# Altium project pcb_power_as.PrjPCB
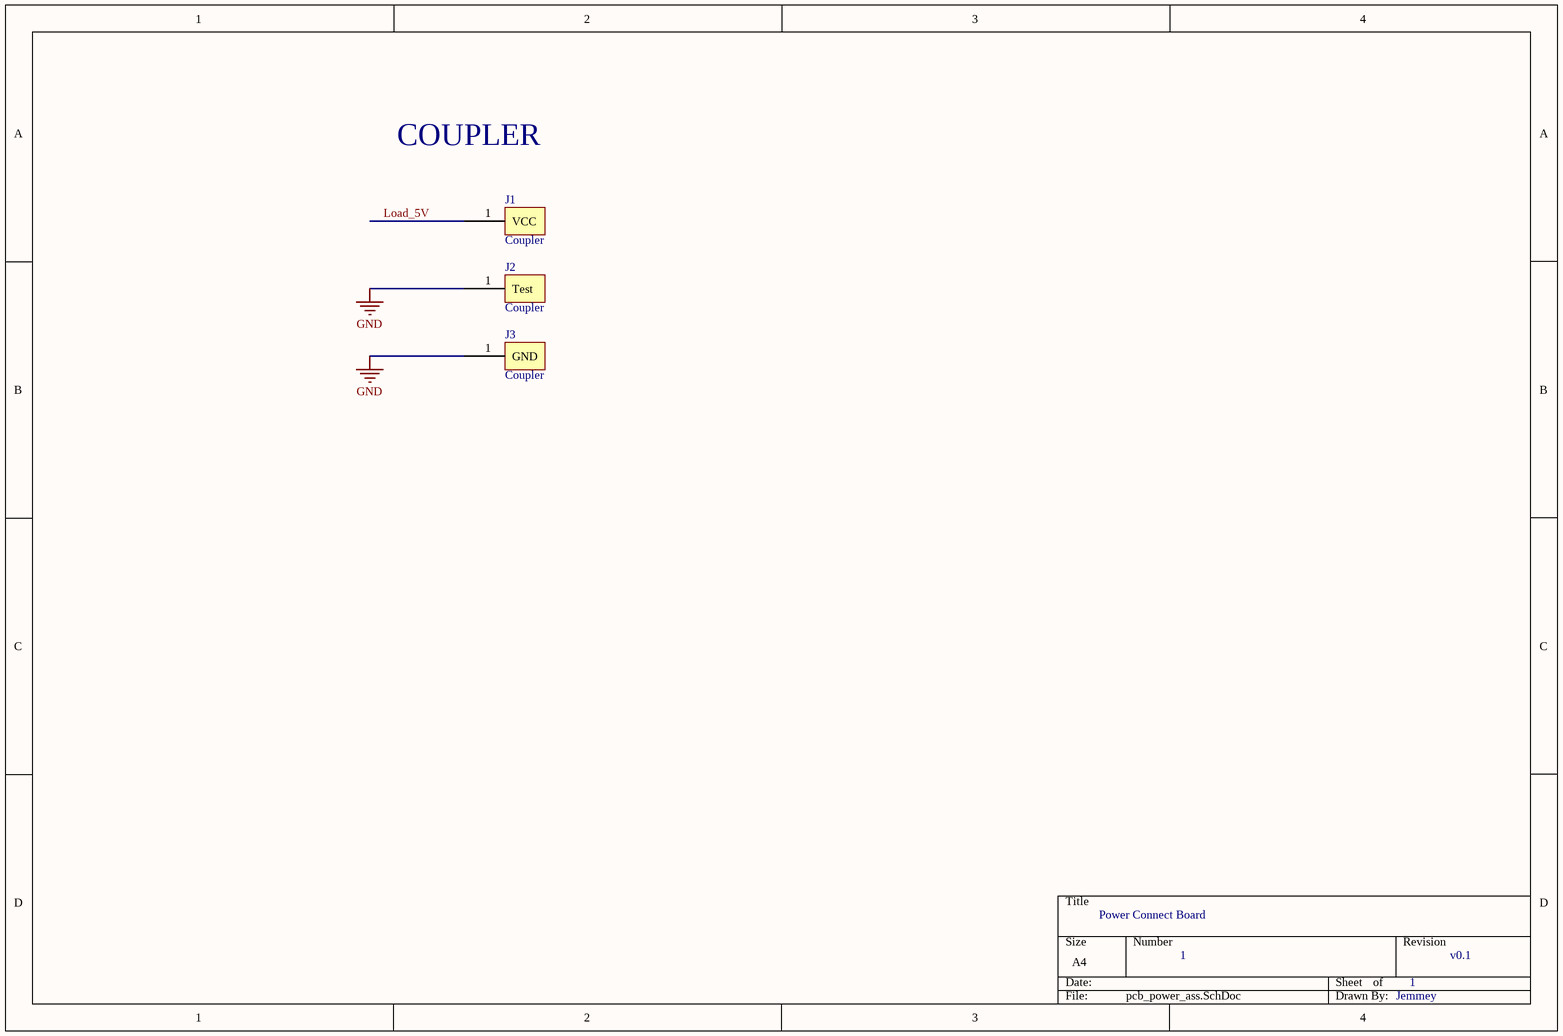
[diagram p0: pcb_power_ass.SchDoc]
1 sheet, 3 parts. Net scope: global (net labels, ports and power ports of the same name join across sheets).
Board file: pcb_power_ass.PcbDoc

## Sheet pcb_power_ass.SchDoc
size A4

### Parts
J1  Coupler  [Charge_Coupler - 1]
J2  Coupler  [Charge_Coupler - 1]
J3  Coupler  [Charge_Coupler - 1]

### Nets
GND: J2.1(Test) J3.1(GND)
Load_5V: J1.1(VCC)

### Notes on the sheet
- COUPLER
- Power Connect Board
- 1
- v0.1
- Jemmey

### Library data of the parts
J1-J3 = Coupler: 厂家：待定；型号：待定